# EAGLE design m303-stereo-output (EAGLE 7.6.0)
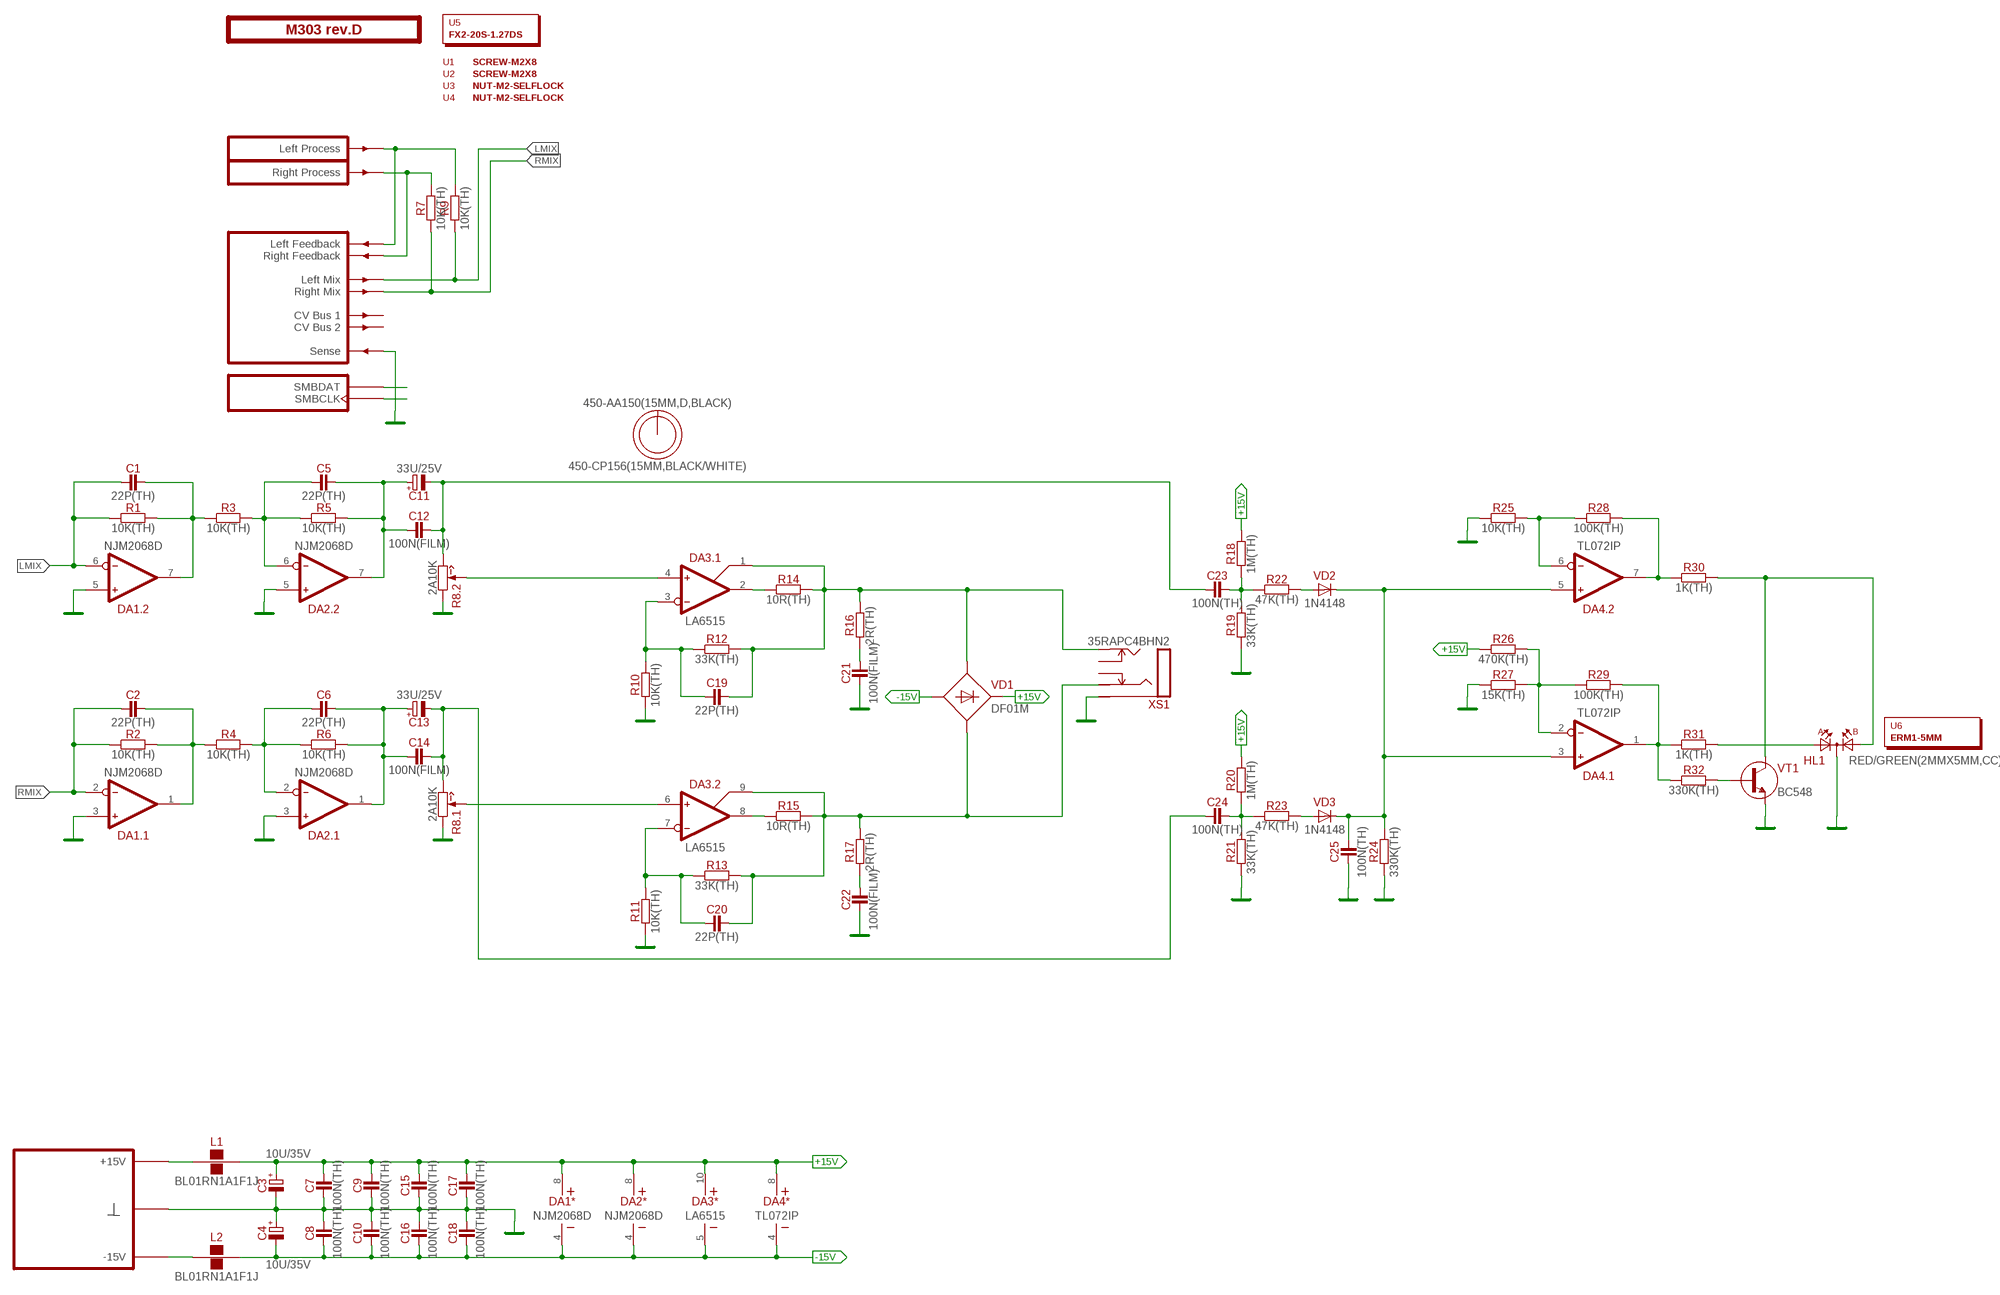
[diagram p0: schematic, sheet 1]

## Parts
C1  22P(TH)  [C050-024X044]
C2  22P(TH)  [C050-024X044]
C3  10U/35V  [E2-5]
C4  10U/35V  [E2-5]
C5  22P(TH)  [C050-024X044]
C6  22P(TH)  [C050-024X044]
C7  100N(TH)  [C050-024X044]
C8  100N(TH)  [C050-024X044]
C9  100N(TH)  [C050-024X044]
C10  100N(TH)  [C050-024X044]
C11  33U/25V  [E2,5-7]
C12  100N(FILM)  [C050-025X075]
C13  33U/25V  [E2,5-7]
C14  100N(FILM)  [C050-025X075]
C15  100N(TH)  [C050-024X044]
C16  100N(TH)  [C050-024X044]
C17  100N(TH)  [C050-024X044]
C18  100N(TH)  [C050-024X044]
C19  22P(TH)  [C050-024X044]
C20  22P(TH)  [C050-024X044]
C21  100N(FILM)  [C050-025X075]
C22  100N(FILM)  [C050-025X075]
C23  100N(TH)  [C050-024X044]
C24  100N(TH)  [C050-024X044]
C25  100N(TH)  [C050-024X044]
DA1  NJM2068D  [DIP-8]
DA2  NJM2068D  [DIP-8]
DA3  LA6515  [SIL10]
DA4  TL072IP  [DIP-8]
HL1  RED/GREEN(2MMX5MM,CC)  [LED2X5-3PIN]
L1  BL01RN1A1F1J  [BL01RN1A]
L2  BL01RN1A1F1J  [BL01RN1A]
O1  450-AA150(15MM,D,BLACK)  [EMPTY]
O2  450-CP156(15MM,BLACK/WHITE)  [EMPTY]
PCB1  M303 rev.D  ST2-BOARD-50-END  [ST2-BOARD-50-END]
R1  10K(TH)  [R-0207/10]
R2  10K(TH)  [R-0207/10]
R3  10K(TH)  [R-0207/10]
R4  10K(TH)  [R-0207/10]
R5  10K(TH)  [R-0207/10]
R6  10K(TH)  [R-0207/10]
R7  10K(TH)  [R-0207/10]
R8  2A10K  [RV11-DUAL]
R9  10K(TH)  [R-0207/10]
R10  10K(TH)  [R-0207/10]
R11  10K(TH)  [R-0207/10]
R12  33K(TH)  [R-0207/10]
R13  33K(TH)  [R-0207/10]
R14  10R(TH)  [R-0207/10]
R15  10R(TH)  [R-0207/10]
R16  2R(TH)  [R-0207/10]
R17  2R(TH)  [R-0207/10]
R18  1M(TH)  [R-0207/10]
R19  33K(TH)  [R-0207/10]
R20  1M(TH)  [R-0207/10]
R21  33K(TH)  [R-0207/10]
R22  47K(TH)  [R-0207/10]
R23  47K(TH)  [R-0207/10]
R24  330K(TH)  [R-0207/10]
R25  10K(TH)  [R-0207/10]
R26  470K(TH)  [R-0207/10]
R27  15K(TH)  [R-0207/10]
R28  100K(TH)  [R-0207/10]
R29  100K(TH)  [R-0207/10]
R30  1K(TH)  [R-0207/10]
R31  1K(TH)  [R-0207/10]
R32  330K(TH)  [R-0207/10]
U1  SCREW-M2X8  [EMPTY]
U2  SCREW-M2X8  [EMPTY]
U3  NUT-M2-SELFLOCK  [EMPTY]
U4  NUT-M2-SELFLOCK  [EMPTY]
U5  FX2-20S-1.27DS  [EMPTY]
U6  ERM1-5MM  [EMPTY]
VD1  DF01M  [MDIP-4]
VD2  1N4148  [DO35-7]
VD3  1N4148  [DO35-7]
VT1  BC548  [TO92]
XS1  35RAPC4BHN2  [35RAP]

## Nets
+15V [power]: C3.+ C7.2 C9.2 C15.2 C17.2 DA1.8(*:V+) DA2.8(*:V+) DA3.10(*:V+) DA4.8(*:V+) L1.2 R18.2 R20.2 R26.1 VD1.3(C)
-15V: C4.- C8.1 C10.1 C16.1 C18.1 DA1.4(*:V-) DA2.4(*:V-) DA3.5(*:V-) DA4.4(*:V-) L2.2 VD1.4(A)
GND: C3.- C4.+ C7.1 C8.2 C9.1 C10.2 C15.1 C16.2 C17.1 C18.2 C21.1 C22.1 C25.1 DA1.3(.1:IN+) DA1.5(.2:IN+) DA2.3(.1:IN+) DA2.5(.2:IN+) HL1.K PCB1.B4(GND) PCB1.B5(GND) PCB1.B6(GND) PCB1.B7(GND) PCB1.B8(GND) PCB1.BSENSE(SENSE) R8.1'(.2:CCW) R8.1(.1:CCW) R10.1 R11.1 R19.1 R21.1 R24.1 R25.1 R27.1 VT1.3(E) XS1.1(S)
LMIX: C1.1 DA1.6(.2:IN-) PCB1.ALMIX(LMIX) R1.1 R9.1
N$1: L1.1 PCB1.A+15(P+15V) PCB1.B+15(P+15V)
N$2: C24.2 R20.1 R21.2 R23.1
N$3: DA3.6(.2:IN+) R8.2(.1:W)
N$4: C25.2 DA4.3(.1:IN+) DA4.5(.2:IN+) R24.2 VD2.C VD3.C
N$5: L2.1 PCB1.A-15(P-15V) PCB1.B-15(P-15V)
N$7: C1.2 DA1.7(.2:OUT) R1.2 R3.1
N$8: C2.2 DA1.1(.1:OUT) R2.2 R4.1
N$9: DA3.4(.1:IN+) R8.2'(.2:W)
N$10: C13.- C14.2 C24.1 R8.3(.1:CW)
N$11: C19.2 DA3.1(.1:SENSE) R12.2 R14.2 R16.2 VD1.1(AC1) XS1.2(T)
N$12: C19.1 DA3.3(.1:IN-) R10.2 R12.1
N$13: DA4.6(.2:IN-) R25.2 R28.1
N$14: DA3.2(.1:OUT) R14.1
N$15: C11.- C12.2 C23.1 R8.3'(.2:CW)
N$16: C21.2 R16.1
N$17: DA4.7(.2:OUT) R28.2 R30.1
N$20: C23.2 R18.1 R19.2 R22.1
N$21: R22.2 VD2.A
N$22: C20.1 DA3.7(.2:IN-) R11.2 R13.1
N$23: R23.2 VD3.A
N$24: C20.2 DA3.9(.2:SENSE) R13.2 R15.2 R17.2 VD1.2(AC2) XS1.3(R)
N$29: HL1.A2 R30.2 VT1.1(C)
N$30: DA4.2(.1:IN-) R26.2 R27.2 R29.1
N$31: DA4.1(.1:OUT) R29.2 R31.1 R32.1
N$32: R32.2 VT1.2(B)
N$33: HL1.A1 R31.2
N$38: PCB1.ASMBDAT(SMBDAT)
N$39: PCB1.ARFBK(RFBK) PCB1.BINR(INR) R7.2
N$40: PCB1.ALFBK(LFBK) PCB1.BINL(INL) R9.2
N$43: PCB1.ASMBCLK(SMBCLK)
N$45: DA3.8(.2:OUT) R15.1
N$46: C22.2 R17.1
N$54: C5.1 DA2.6(.2:IN-) R3.2 R5.1
N$55: C5.2 C11.+ C12.1 DA2.7(.2:OUT) R5.2
N$56: C6.1 DA2.2(.1:IN-) R4.2 R6.1
N$57: C6.2 C13.+ C14.1 DA2.1(.1:OUT) R6.2
RMIX: C2.1 DA1.2(.1:IN-) PCB1.ARMIX(RMIX) R2.1 R7.1
Unconnected: PCB1.ACV1(CV1) PCB1.ACV2(CV2) XS1.10(TN) XS1.11(RN)

## Library data of the parts
C1 C2 C5 C6 C19 C20 = capacitors:?
C3 C4 = capacitors-electrolytic:?; MOUSER: 647-USW1V100MDD
C7-C10 C15-C18 C23-C25 = capacitors:?; MOUSER: 81-RCER71H104K0A2H3B
C11 C13 = capacitors-electrolytic:?
C12 C14 C21 C22 = capacitors:?; MOUSER: 505-MKS2.1/63/5
DA1 DA2 = ic-jrc:NJM2068; MOUSER: 513-NJM2068D
DA3 = ic-sanyo:LA6515
DA4 = ic-ti:TL072; MOUSER: 595-TL072IP
HL1 = optoelectronics:?(2MMX5MM,CC)
L1 L2 = inductors:BL01RN1A?; MOUSER: 81-BL01RN1A1F1J
O1 = hardware:450-AA?; MOUSER: 450-AA150
O2 = hardware:450-C?; MOUSER: 450-CP156
PCB1 = module-footprints:ST2-BOARD-50-END
R1-R7 R9-R11 R25 = resistors:?; MOUSER: 71-RN55D-F-10K
R8 = potentiometers:2**?; MOUSER: 688-RK12L12C0A0E
R12 R13 R16-R24 R26 R27 R32 = resistors:?
R14 R15 = resistors:?; MOUSER: 71-RN55D-F-10/R
R28 R29 = resistors:?; MOUSER: 71-RN55D-F-100K
R30 R31 = resistors:?; MOUSER: 71-RN55D-F-1.0K
U1-U4 = hardware:*?
U5 = hardware:?; MOUSER: 798-FX2-20S-1.27DS71
U6 = hardware:?
VD1 = diodes:DF?M; MOUSER: 512-DF01M
VD2 VD3 = diodes:?; MOUSER: 583-1N4148-T
VT1 = transistors-npn:?
XS1 = connectors:35RAPC4BHN2; MOUSER: 502-35RAPC4BHN2

## Board
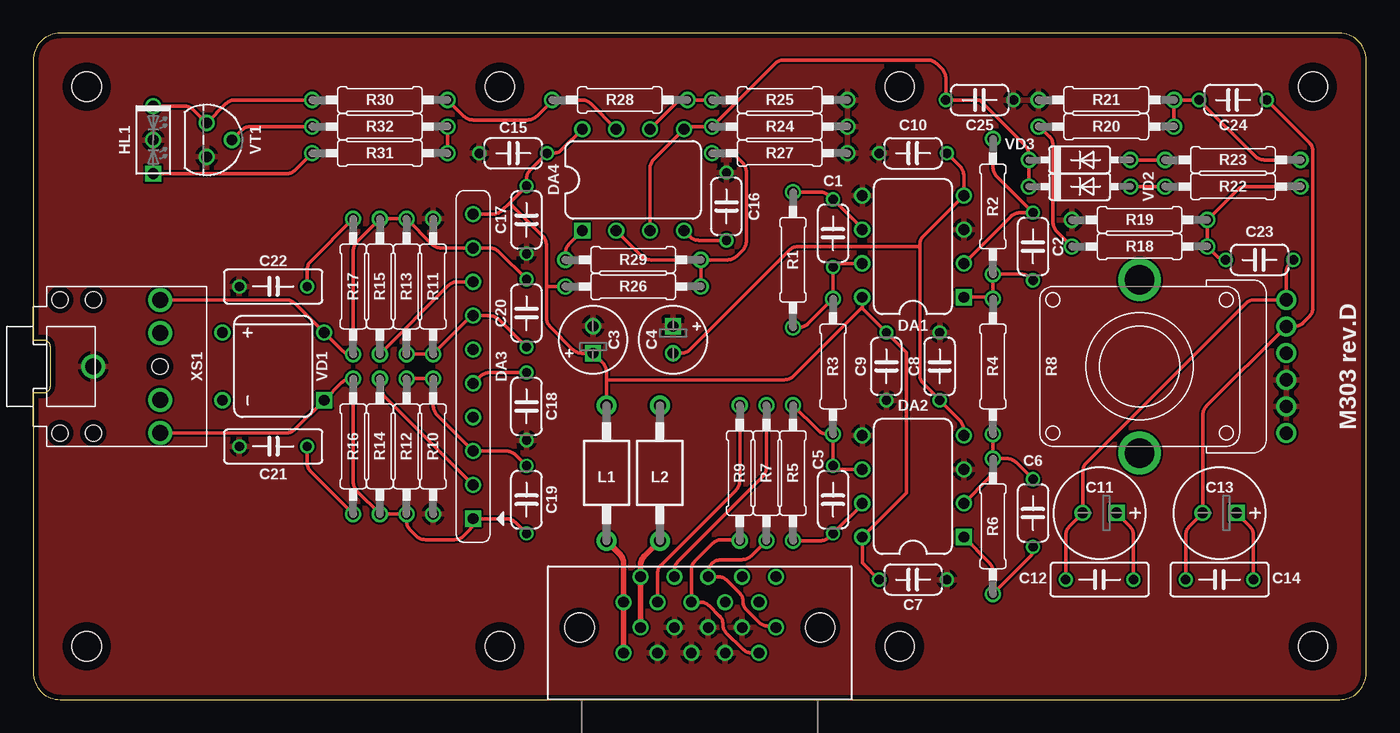
[diagram p1: board, top side]
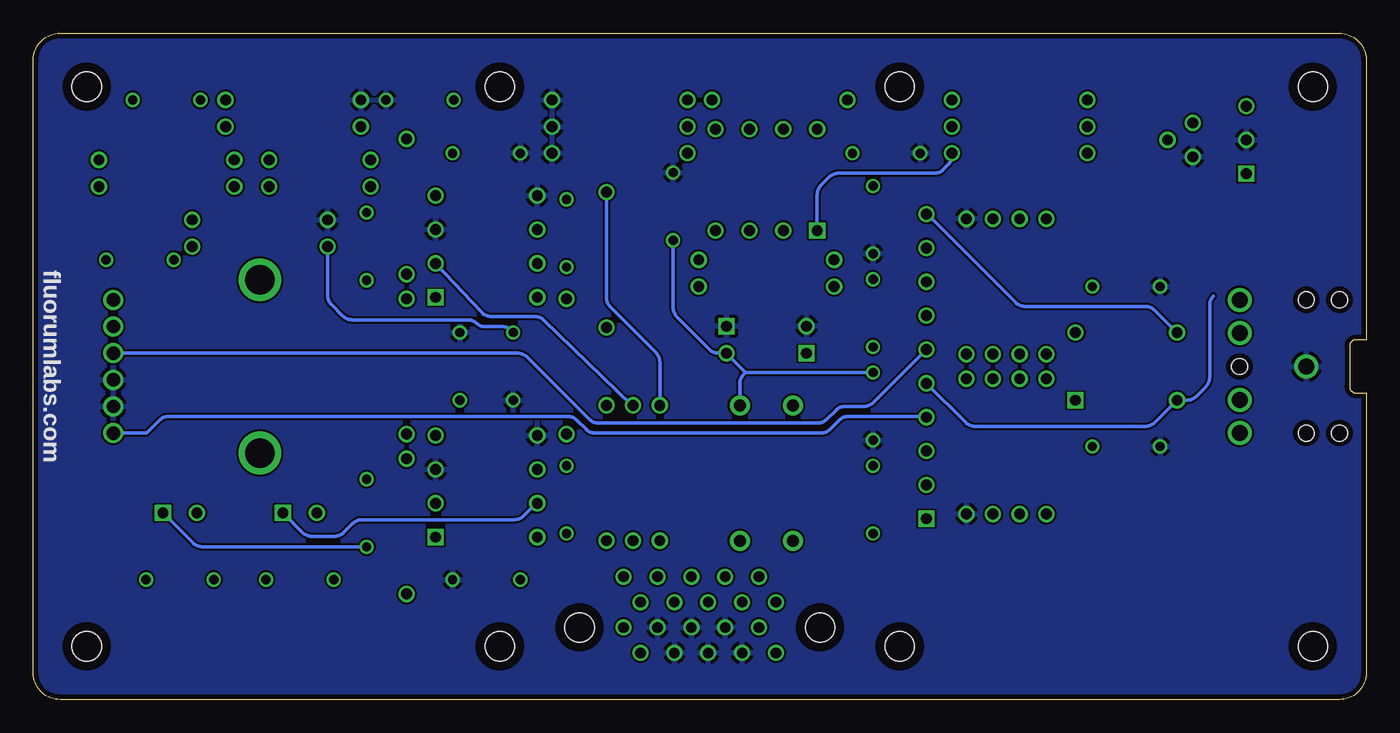
[diagram p2: board, bottom side, seen from below]

Size 100 x 50 mm. Coordinates in mm from the lower left corner, seen from the top.
Outline: 2,0 98,0 arc90 100,2 100,48 arc90 98,50 2,50 arc90 0,48 0,27 0.75,27 arc-90 1.25,26.5 1.25,23.5 arc-90 0.75,23 0,23 0,2 arc90 2,0
Copper layers (1*16): Top 0.0356mm / dielectric 1.5011mm / Bottom 0.0356mm
Design rules "LaenPCBOrder": minimum track width 6mil, minimum drill 13mil, track to track 6mil, track to pad 6mil, pad to pad 6mil, via to via 6mil, smd to smd 6mil, copper to edge 15mil, drill to drill 6mil, minimum pad ring 7mil, minimum via ring 7mil, stop-mask expansion 3mil, vias tented up to drill 0mil, thermal gap 10mil

### Footprints (pad centres in the part's own frame; a part is rotated, then mirrored left to right if it is on the bottom)
C050-024X044 = drill 0.7: 1 -2.54,0; 2 2.54,0
E2-5 = drill 0.813 square: + -1.016,0 | drill 0.813: - 1.016,0
E2,5-7 = drill 0.813 square: + -1.27,0 | drill 0.813: - 1.27,0
C050-025X075 = drill 0.7: 1 -2.54,0; 2 2.54,0
DIP-8 = drill 0.813 square: 1 -3.81,-3.81 | drill 0.813: 2 -1.27,-3.81; 3 1.27,-3.81; 4 3.81,-3.81; 5 3.81,3.81; 6 1.27,3.81; 7 -1.27,3.81; 8 -3.81,3.81
SIL10 = drill 0.813 square: 1 -11.43,0 | drill 0.813: 2 -8.89,0; 3 -6.35,0; 4 -3.81,0; 5 -1.27,0; 6 1.27,0; 7 3.81,0; 8 6.35,0; 9 8.89,0; 10 11.43,0
LED2X5-3PIN = drill 0.813 square: A1 -2.54,0 | drill 0.813: A2 2.54,0; K 0,0
BL01RN1A = drill 0.9 pad 1.5: 1 -5.08,0; 2 5.08,0
ST2-BOARD-50-END = drill 0.8: A+15 44.285,7.31; A-15 45.555,9.215; ACV1 51.905,7.31; ACV2 53.175,9.215; ALFBK 49.365,7.31; ALMIX 46.825,7.31; ARFBK 50.635,9.215; ARMIX 48.095,9.215; ASMBCLK 55.715,9.215; ASMBDAT 54.445,7.31; B4 48.095,5.405; B5 49.365,3.5; B6 50.635,5.405; B7 51.905,3.5; B8 53.175,5.405; B+15 44.285,3.5; B-15 45.555,5.405; BINL 54.445,3.5; BINR 55.715,5.405; BSENSE 46.825,3.5 | hole 2.2: 4,4; 4,46; 96,4; 96,46; 35,46; 65,46; 65,4; 35,4; 59.025,5.405; 40.975,5.405
R-0207/10 = drill 0.813: 1 -5.08,0; 2 5.08,0
RV11-DUAL = drill 1: 1 -1,-11; 1' -3,-11; 2 1,-11; 2' -5,-11; 3 3,-11; 3' 5,-11 | drill 2.2: S1 -6.5,0; S2 6.5,0
MDIP-4 = drill 0.813 square: 1 -2.54,-3.81 | drill 0.813: 2 2.54,-3.81; 3 2.54,3.81; 4 -2.54,3.81
DO35-7 = drill 0.813: A 3.81,0; C -3.81,0
TO92 = drill 0.813: 1 -1.27,0; 2 0,1.905; 3 1.27,0
35RAP = drill 1.2: 1 4.5,0; 2 9.5,-5; 3 9.5,5; 10 9.5,-2.5; 11 9.5,2.5 | hole 1.2: 2,5; 2,-5; 4.5,5; 4.5,-5; 9.5,0

### Placement (x,y rotation side)
C1  60,35 270 top
C2  75,34 270 top
C3  42,27 90 top
C4  48,27 270 top
C5  60,15 270 top
C6  75,14 270 top
C7  66,9 180 top
C8  68,25 90 top
C9  64,25 90 top
C10  66,41 180 top
C11  80,14 180 top
C12  80,9 180 top
C13  89,14 180 top
C14  89,9 180 top
C15  36,41 0 top
C16  52,37 90 top
C17  37,36 90 top
C18  37,22 270 top
C19  37,15 270 top
C20  37,29 90 top
C21  18,19 0 top
C22  18,31 0 top
C23  92,33 180 top
C24  90,45 180 top
C25  71,45 180 top
DA1  66,34 90 top
DA2  66,16 90 top
DA3  33,25 90 top
DA4  45,39 0 top
HL1  9,42 90 top
L1  43,17 90 top
L2  47,17 90 top
O1  92,-106 0 top  (outside the outline)
O2  95,-106 0 top  (outside the outline)
PCB1  0,0 0 top
R1  57,33 270 top
R2  72,37 270 top
R3  60,25 270 top
R4  72,25 270 top
R5  57,17 270 top
R6  72,13 270 top
R7  55,17 270 top
R8  2*A10K  [RV11-DUAL]  83,25 90 top
R9  53,17 270 top
R10  30,19 90 top
R11  30,31 270 top
R12  28,19 270 top
R13  28,31 90 top
R14  26,19 270 top
R15  26,31 90 top
R16  24,19 90 top
R17  24,31 270 top
R18  83,34 180 top
R19  83,36 0 top
R20  80.5,43 180 top
R21  80.5,45 0 top
R22  90,38.5 180 top
R23  90,40.5 180 top
R24  56,43 180 top
R25  56,45 180 top
R26  45,31 0 top
R27  56,41 180 top
R28  44,45 180 top
R29  45,33 180 top
R30  26,45 180 top
R31  26,41 180 top
R32  26,43 180 top
U1  98,-106 0 top  (outside the outline)
U2  1,-109 0 top  (outside the outline)
U3  4,-109 0 top  (outside the outline)
U4  7,-109 0 top  (outside the outline)
U5  10,-109 0 top  (outside the outline)
U6  7,-151 0 top  (outside the outline)
VD1  18,25 90 top
VD2  78.5,38.5 0 top
VD3  78.5,40.5 0 top
VT1  13,42 270 top
XS1  0,25 0 top

### Tracks (layer width: path | path; a pad name or v marks a point on that pad's centre or on a via)
+15V
  Top 0.254: DA3.10 34.48,36.43 arc45 35.18,36.72 35.73,37.27 | 35.73,37.27 C17.2 37,39.05 arc-45 37.29,39.75 C15.2 38.97,41 arc45 39.67,41.29 DA4.8 | DA1.8 62.19,29.35 | 62.19,29.35 C9.2 65.5,26.04 65.5,15.5 DA2.8 62.19,10.27 C7.2 | L1.2 43,24 | 43,24 43,24.57 arc45 42.71,25.28 C3.+ 41.18,25.98 arc-45 40.47,26.28 38.79,27.96 arc-45 38.5,28.66 38.5,31 | 38.5,31 38.5,34.09 arc45 38.21,34.79 35.73,37.27 | 62.19,29.35 62.1,29.35 57.04,24.29 arc-45 56.34,24 43,24 | R20.2 75.5,43 76.21,42.29 arc-45 76.5,41.59 76.5,35.83 arc45 76.79,35.13 R18.2 | R26.1 38.5,31
  Bottom 0.254: DA3.10 32.93,36.43 26.29,29.79 arc-45 25.59,29.5 16.56,29.5 arc45 15.86,29.21 VD1.3 | R18.2 77.92,30.33 arc-45 77.63,29.63 76.79,28.79 arc-45 76.09,28.5 67.41,28.5 arc45 66.71,28.21 arc-45 66.21,28 64.87,28 arc45 64.17,27.71 C9.2
-15V
  Top 0.254: DA2.4 69.81,20.24 arc45 69.52,20.94 C8.1 68,22.5 66.79,23.71 arc-45 66.5,24.41 66.5,34.09 | C10.1 69.52,40.02 arc-45 69.81,39.32 DA1.4 66.79,34.79 arc45 66.5,34.09 | C18.1 34.22,24.54 arc45 33.52,24.25 DA3.5 | C4.- 48.57,25.98 arc45 49.28,26.28 56.71,33.71 arc-45 57.41,34 66.41,34 66.5,34.09 | C16.1 49.95,34.46 arc-45 49.25,34.75 DA4.4
  Bottom 0.254: C18.1 46.56,24.54 | 46.56,24.54 C4.- 48.57,25.98 arc45 49.28,26.28 51.71,28.71 arc45 52,29.41 C16.1 | DA3.5 32.98,23.73 30.04,20.79 arc-45 29.34,20.5 16.56,20.5 arc-45 15.86,20.79 VD1.4 13.45,22.46 arc-45 12.75,22.75 12.04,23.46 arc-45 11.75,24.16 11.75,29.57 arc45 11.46,30.27 | L2.2 47,23.68 arc45 46.71,24.39 46.56,24.54
GND
  pour Bottom: 0,50 98,50 arc-90 100,48 100,0 2,0 arc-90 0,2
  pour Top: 0,50 98,50 arc-90 100,48 100,0 2,0 arc-90 0,2
LMIX
  Top 0.254: DA1.6 62.19,35.35 C1.1 59.75,37.79 arc45 59.05,38.08 R1.1 | PCB1.ALMIX 46.83,9.41 arc-45 47.12,10.12 52.71,15.71 arc45 53,16.41 R9.1
  Bottom 0.254: R9.1 53,25.34 arc-45 53.29,26.04 56.71,29.46 arc45 57,30.16 R1.1
N$1
  Top 0.406: PCB1.B+15 PCB1.A+15 44.28,10.22 arc45 43.99,10.93 L1.1
N$2
  Top 0.254: R20.1 R21.2 C24.2 91.67,40.79 arc45 92.37,40.5 R23.1
N$3
  Bottom 0.254: R8.2 63.66,26 arc45 62.96,25.71 58.29,21.04 arc-45 57.59,20.75 41.16,20.75 arc-45 40.46,21.04 39.79,21.71 arc45 39.09,22 37.68,22 arc-45 36.98,22.29 DA3.6
N$4
  Top 0.254: VD2.C VD3.C 74.69,40.9 arc45 74.4,41.6 71,45 C25.2 68.46,46.63 arc45 68.17,47.33 67.79,47.71 arc45 67.09,48 56.33,48 arc45 55.63,47.71 R24.2 49,43 DA4.5 46.56,40.56 arc45 46.27,39.86 DA4.3
N$5
  Top 0.406: PCB1.B-15 PCB1.A-15 45.55,10.06 arc-45 45.85,10.77 L2.1
N$7
  Top 0.254: DA1.7 60.65,32.73 arc45 C1.2 R3.1 58.13,28.21 arc-45 57.43,27.92 R1.2
N$8
  Top 0.254: DA1.1 71.89,30.19 R4.1 R2.2 74.13,31.92 arc-45 74.83,31.63 C2.2
N$9
  Bottom 0.254: R8.2' 91.5,20 90.54,20.96 arc45 89.84,21.25 59.91,21.25 arc45 59.21,20.96 58.54,20.29 arc-45 57.84,20 40.91,20 arc-45 40.21,20.29 39.54,20.96 arc45 38.84,21.25 33.06,21.25 DA3.4
N$10
  Top 0.254: C14.2 86.46,12.32 arc-45 86.75,13.02 C13.- 87.73,21.32 arc-45 88.02,22.02 R8.3 94.59,28 arc45 95.29,28.29 95.71,28.71 arc45 96,29.41 96,41.13 arc45 95.71,41.83 C24.1
N$11
  Top 0.254: XS1.2 18.94,20 arc45 19.64,20.29 VD1.1 23.14,23.79 arc-45 23.84,24.08 R16.2 24,16.33 arc45 24.29,15.63 R14.2 R12.2 28,13.41 arc45 28.29,12.71 28.71,12.29 arc45 29.41,12 31.59,12 arc45 32.29,12.29 32.71,12.71 arc45 33,13.41 DA3.1 35.48,13.57 arc-45 36.18,13.28 C19.2
N$12
  Top 0.254: R12.1 R10.2 30,22.06 arc45 30.29,21.36 DA3.3 35.48,18.65 arc-45 36.18,18.36 C19.1
N$13
  Top 0.254: DA4.6 48.17,44.71 arc-45 48.87,45 R28.1 R25.2
N$14
  Top 0.254: R14.1 26,23.52 arc45 26.29,22.82 DA3.2
N$15
  Top 0.254: C12.2 77.46,12.32 arc-45 77.75,13.02 C11.- 78.73,17.07 arc-45 79.02,17.77 90.96,29.71 arc-45 91.66,30 R8.3' 94,32.05 arc-45 94.29,32.75 C23.1
N$16
  Top 0.254: C21.2 20.54,17.79 arc45 20.83,17.09 R16.1
N$17
  Top 0.254: DA4.7 41.83,44.71 arc45 41.13,45 R28.2 38.92,44.92 37.79,43.79 arc-45 37.09,43.5 32.99,43.5 arc-45 32.29,43.79 R30.1
N$20
  Top 0.254: C23.2 arc-45 88.81,33.27 R18.1 R19.2 90.29,38.21 arc-45 90.99,38.5 R22.1
N$21
  Top 0.254: R22.2 VD2.A
N$22
  Top 0.254: R13.1 R11.2 32.81,28.73 arc-45 DA3.7 34.24,28.81 arc-45 34.94,28.52 C20.1
N$23
  Top 0.254: R23.2 VD3.A
N$24
  Top 0.254: XS1.3 18.94,30 arc-45 19.64,29.71 VD1.2 23.14,26.21 arc45 23.84,25.92 R17.2 24,33.67 arc-45 24.29,34.37 R15.2 R13.2 29.9,34.18 arc45 30.6,33.89 DA3.9 34.24,33.89 arc-45 34.94,33.6 C20.2
N$29
  Top 0.254: HL1.A2 11.32,44.54 arc-45 12.02,44.25 VT1.1 14.44,44.71 arc-45 15.14,45 R30.2
N$30
  Top 0.254: R29.1 46.33,33 arc-45 45.63,33.29 DA4.2 | R26.2 R29.1 | R27.2 52.09,41 arc-45 52.79,40.71 53.21,40.29 arc-45 53.5,39.59 53.5,34.41 arc-45 53.21,33.71 52.79,33.29 arc-45 52.09,33 R29.1
N$31
  Top 0.254: R29.2 39.92,33.51 arc-45 40.21,34.21 DA4.1 | R32.1 R31.1
  Bottom 0.254: R31.1 31.08,40.83 arc45 31.37,40.13 31.71,39.79 arc45 32.41,39.5 39.59,39.5 arc-45 40.29,39.21 40.9,38.6 arc-45 41.19,37.9 DA4.1
N$32
  Top 0.254: R32.2 16.32,43 arc45 15.61,42.71 VT1.2
N$33
  Top 0.254: HL1.A1 18.97,39.46 arc45 19.67,39.75 R31.2
N$39
  Top 0.254: PCB1.BINR 55.62,5.5 55.16,5.5 arc-45 54.46,5.79 53.49,6.76 arc-45 53.25,7.34 arc45 52.96,8.04 52.08,8.92 arc45 51.37,9.21 PCB1.ARFBK 50.63,9.5 arc-90 51.63,10.5 53.17,10.5 arc45 53.87,10.79 R7.2
N$40
  Top 0.254: PCB1.BINL 53.91,3.5 arc-45 53.21,3.79 51.99,5.01 arc-45 51.75,5.59 arc45 51.46,6.29 50.73,7.02 arc45 50.03,7.31 PCB1.ALFBK 49.37,9.7 arc-45 49.66,10.41 50.96,11.71 arc-45 51.66,12 52.92,12 R9.2
N$45
  Top 0.254: DA3.8 31.84,31.35 arc45 31.14,31.06 R15.1
N$46
  Top 0.254: C22.2 20.54,32.21 arc-45 20.83,32.91 R17.1
N$54
  Top 0.254: DA2.6 60.65,17.27 arc-45 C5.1 R3.2 59.57,19.92 arc-45 58.87,20.21 R5.1
N$55
  Top 0.254: DA2.7 62.19,14.65 C5.2 59.75,12.21 arc-45 59.05,11.92 R5.2 | C12.1 82.54,12.32 arc45 82.25,13.02 C11.+
  Bottom 0.254: DA2.7 62.27,14.73 63.21,13.79 arc45 63.91,13.5 75.34,13.5 arc-45 76.04,13.21 76.71,12.54 arc45 77.41,12.25 79.11,12.25 arc45 79.81,12.54 C11.+
N$56
  Top 0.254: R6.1 72,17.33 arc-45 71.71,16.63 DA2.2 | R6.1 73.05,18.08 arc-45 73.75,17.79 C6.1 | R6.1 R4.2
N$57
  Top 0.254: DA2.1 71.71,10.29 arc-45 72,9.59 R6.2 74.71,10.63 arc45 75,11.33 C6.2 | C14.1 91.54,12.32 arc45 91.25,13.02 C13.+
  Bottom 0.254: C6.2 87.32,11.46 arc45 88.02,11.75 C13.+
RMIX
  Top 0.254: PCB1.ARMIX 48.09,9.68 arc-45 48.39,10.39 54.71,16.71 arc45 55,17.41 R7.1 | R2.1 72,39.95 arc45 72.29,39.25 C2.1 74.03,36.54 arc45 73.33,36.25 DA1.2
  Bottom 0.254: R7.1 55.08,22.08 61.71,28.47 arc-44 62.4,28.75 65.65,28.75 arc47 66.38,29.07 DA1.2